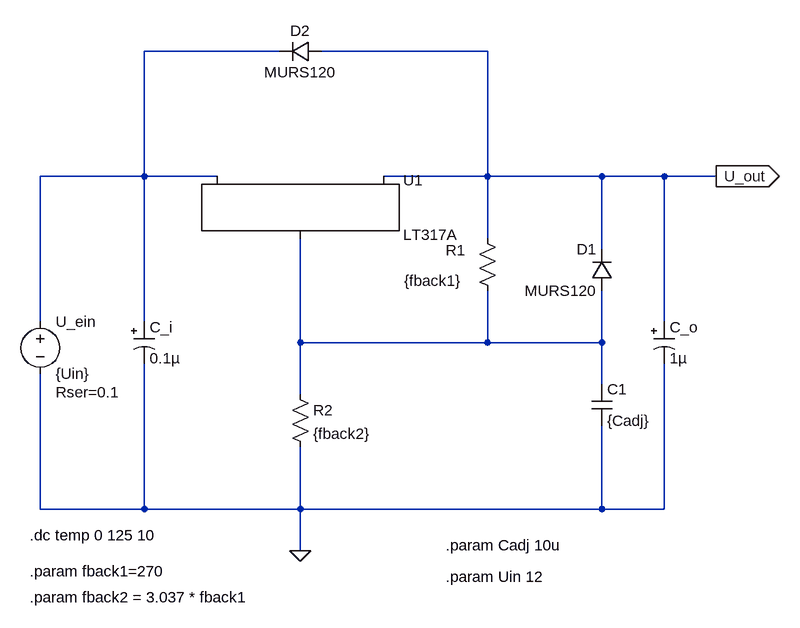
[diagram p0: schematic LM317.asc]
LM317.asc, the LTspice schematic file:
Version 4
SHEET 1 1896 892
WIRE 192 -32 -16 -32
WIRE 512 -32 256 -32
WIRE -16 160 -16 -32
WIRE -16 160 -176 160
WIRE 96 160 -16 160
WIRE 512 160 512 -32
WIRE 512 160 352 160
WIRE 688 160 512 160
WIRE 784 160 688 160
WIRE 864 160 784 160
WIRE 512 256 512 160
WIRE 688 272 688 160
WIRE -176 384 -176 160
WIRE -16 384 -16 160
WIRE 784 384 784 160
WIRE 224 416 224 256
WIRE 512 416 512 336
WIRE 512 416 224 416
WIRE 688 416 688 336
WIRE 688 416 512 416
WIRE 688 480 688 416
WIRE 224 496 224 416
WIRE -176 672 -176 464
WIRE -16 672 -16 448
WIRE -16 672 -176 672
WIRE 224 672 224 576
WIRE 224 672 -16 672
WIRE 688 672 688 544
WIRE 688 672 224 672
WIRE 784 672 784 448
WIRE 784 672 688 672
WIRE 224 736 224 672
FLAG 224 736 0
FLAG 864 160 U_out
IOPIN 864 160 Out
SYMBOL PowerProducts\\LT317A 224 160 R0
SYMATTR InstName U1
SYMBOL diode 704 336 R180
WINDOW 0 24 64 Left 2
WINDOW 3 24 0 Left 2
SYMATTR InstName D1
SYMATTR Value MURS120
SYMBOL diode 256 -48 R90
WINDOW 0 0 32 VBottom 2
WINDOW 3 32 32 VTop 2
SYMATTR InstName D2
SYMATTR Value MURS120
SYMBOL polcap -32 384 R0
WINDOW 3 24 56 Left 2
SYMATTR Value 0.1µ
SYMATTR InstName C_i
SYMATTR Description Capacitor
SYMATTR Type cap
SYMATTR SpiceLine V=50 Irms=22m Rser=3.9 Lser=0
SYMBOL polcap 768 384 R0
WINDOW 3 24 56 Left 2
SYMATTR Value 1µ
SYMATTR InstName C_o
SYMATTR Description Capacitor
SYMATTR Type cap
SYMATTR SpiceLine V=50 Irms=36m Rser=3.5 Lser=0 mfg="Nichicon" pn="UPL1H010MAH" type="Al electrolytic"
SYMBOL voltage -176 368 R0
WINDOW 123 0 0 Left 0
WINDOW 39 24 124 Left 2
SYMATTR SpiceLine Rser=0.1
SYMATTR InstName U_ein
SYMATTR Value {Uin}
SYMBOL cap 672 480 R0
SYMATTR InstName C1
SYMATTR Value {Cadj}
SYMBOL res 208 480 R0
SYMATTR InstName R2
SYMATTR Value {fback2}
SYMBOL res 496 240 R0
WINDOW 0 -48 34 Left 2
WINDOW 3 -112 81 Left 2
SYMATTR InstName R1
SYMATTR Value {fback1}
TEXT -192 712 Left 2 !.dc temp 0 125 10
TEXT -192 768 Left 2 !.param fback1=270
TEXT -192 808 Left 2 !.param fback2 = 3.037 * fback1
TEXT 448 776 Left 2 !.param Uin 12
TEXT 448 728 Left 2 !.param Cadj 10u

The netlist it stands for:
* LM317.asc
XU1 N002 U_out N001 LT317A
D1 N002 U_out MURS120
D2 U_out N001 MURS120
C_i N001 0 0.1µ V=50 Irms=22m Rser=3.9 Lser=0
C_o U_out 0 1µ V=50 Irms=36m Rser=3.5 Lser=0 mfg="Nichicon" pn="UPL1H010MAH" type="Al electrolytic"
V§U_ein N001 0 {Uin} Rser=0.1
C1 N002 0 {Cadj}
R2 N002 0 {fback2}
R1 U_out N002 {fback1}
.model D D
.lib standard.dio
.dc temp 0 125 10
.param fback1=270
.param fback2 = 3.037 * fback1
.param Uin 12
.param Cadj 10u
.lib LTC.lib
.backanno
.end